# EAGLE design PCB-TLY-JACK_inverter (EAGLE 7.7.0)

## Sheet 1 of 2
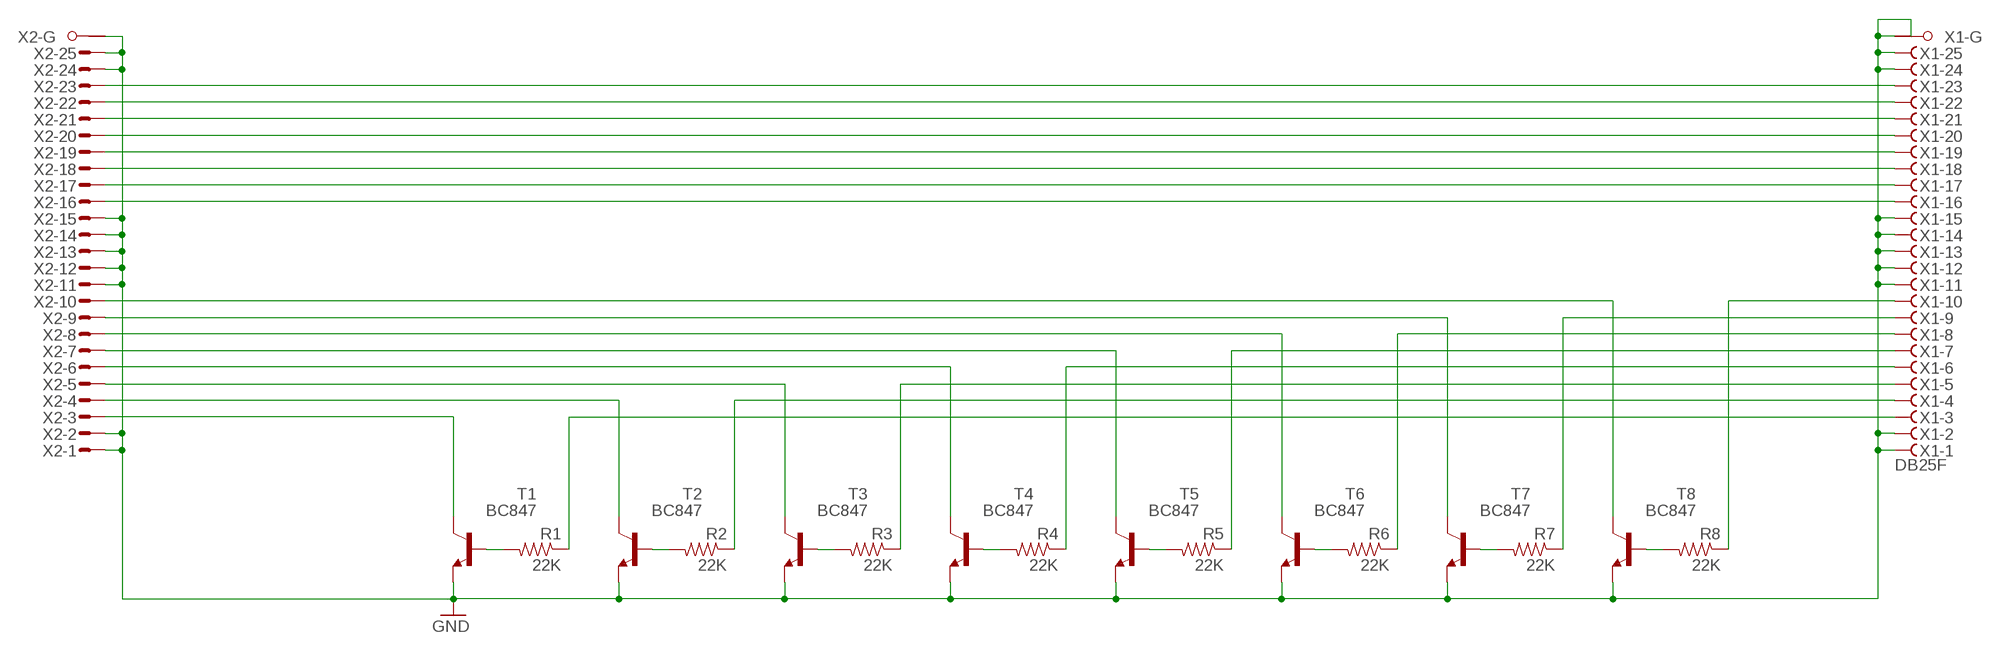
[diagram p0: schematic, sheet 1]

### Parts
R1  22K  RESISTOR0603-RES  [0603-RES]
R2  22K  RESISTOR0603-RES  [0603-RES]
R3  22K  RESISTOR0603-RES  [0603-RES]
R4  22K  RESISTOR0603-RES  [0603-RES]
R5  22K  RESISTOR0603-RES  [0603-RES]
R6  22K  RESISTOR0603-RES  [0603-RES]
R7  22K  RESISTOR0603-RES  [0603-RES]
R8  22K  RESISTOR0603-RES  [0603-RES]
T1  BC847  [SOT23]
T2  BC847  [SOT23]
T3  BC847  [SOT23]
T4  BC847  [SOT23]
T5  BC847  [SOT23]
T6  BC847  [SOT23]
T7  BC847  [SOT23]
T8  BC847  [SOT23]
X1  DB25F  F25HPS  [F25HP]
X2  M25HPS  [M25HP]

### Nets
GND: T1.2(E) T2.2(E) T3.2(E) T4.2(E) T5.2(E) T6.2(E) T7.2(E) T8.2(E) X1.1(-1:F) X1.2(-2:F) X1.11(-11:F) X1.12(-12:F) X1.13(-13:F) X1.14(-14:F) X1.15(-15:F) X1.24(-24:F) X1.25(-25:F) X1.G1(-G:G1) X1.G2(-G:G2) X2.1(-1:M) X2.2(-2:M) X2.11(-11:M) X2.12(-12:M) X2.13(-13:M) X2.14(-14:M) X2.15(-15:M) X2.24(-24:M) X2.25(-25:M) X2.G1(-G:G1)
N$1 [RELAY LINES]: X1.23(-23:F) X2.23(-23:M)
N$2 [INput lines]: T8.3(C) X2.10(-10:M)
N$4: R1.2 T1.1(B)
N$5 [INput lines]: T7.3(C) X2.9(-9:M)
N$6 [RELAY LINES]: X1.22(-22:F) X2.22(-22:M)
N$7 [INput lines]: T6.3(C) X2.8(-8:M)
N$8 [INput lines]: T5.3(C) X2.7(-7:M)
N$9 [INput lines]: T4.3(C) X2.6(-6:M)
N$10 [RELAY LINES]: X1.21(-21:F) X2.21(-21:M)
N$11 [INput lines]: T3.3(C) X2.5(-5:M)
N$12 [INput lines]: T2.3(C) X2.4(-4:M)
N$13: R2.2 T2.1(B)
N$14 [RELAY LINES]: X1.20(-20:F) X2.20(-20:M)
N$15: R3.2 T3.1(B)
N$16: R4.2 T4.1(B)
N$17: R5.2 T5.1(B)
N$18 [RELAY LINES]: X1.19(-19:F) X2.19(-19:M)
N$19: R6.2 T6.1(B)
N$20: R7.2 T7.1(B)
N$21: R8.2 T8.1(B)
N$22 [RELAY LINES]: X1.18(-18:F) X2.18(-18:M)
N$24 [INput lines]: T1.3(C) X2.3(-3:M)
N$25: R1.1 X1.3(-3:F)
N$26 [RELAY LINES]: X1.17(-17:F) X2.17(-17:M)
N$27: R2.1 X1.4(-4:F)
N$28: R3.1 X1.5(-5:F)
N$29: R4.1 X1.6(-6:F)
N$30 [RELAY LINES]: X1.16(-16:F) X2.16(-16:M)
N$31: R5.1 X1.7(-7:F)
N$32: R6.1 X1.8(-8:F)
N$33: R7.1 X1.9(-9:F)
N$34: R8.1 X1.10(-10:F)
Unconnected: X2.G2(-G:G2)

## Sheet 2 of 2

## Library data of the parts
R1-R8 = SparkFun:RESISTOR: Resistor Basic schematic elements and footprints for 0603, 1206, and PTH resistors.
T1-T8 = transistor:BC847: NPN TRANSISTOR
X1 = con-subd:F25HPS: SUB-D; OC_FARNELL: unknown; OC_NEWARK: unknown
X2 = con-subd:M25HPS: SUB-D; OC_FARNELL: unknown; OC_NEWARK: unknown

## Net classes
0 default: width 0.203 mm, drill 0.406 mm, clearance 0.203 mm
1 Power: width 0.406 mm, drill 0.61 mm, clearance 0.203 mm
2 RELAY LINES: width 0.305 mm, drill 0.406 mm, clearance 0.254 mm
3 INput lines: width 0.203 mm, drill 0.406 mm, clearance 0.254 mm

## Board
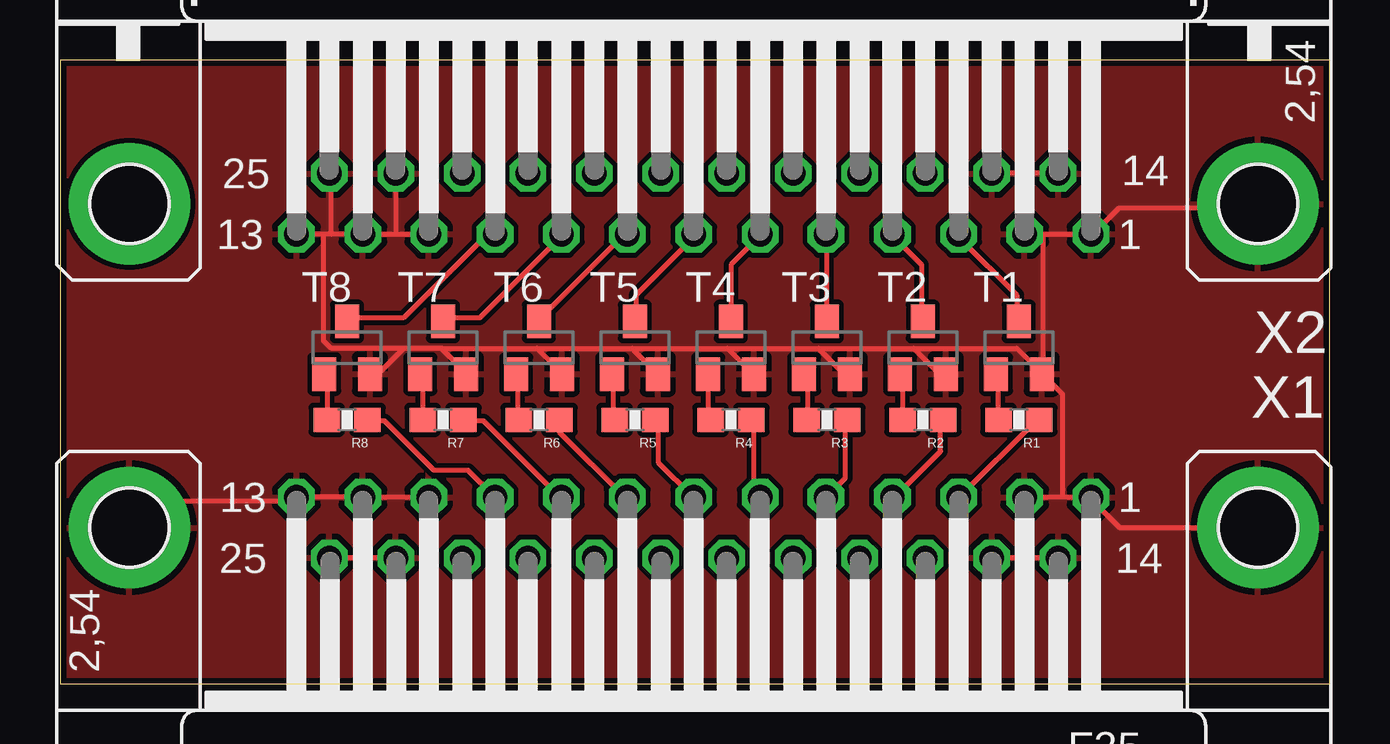
[diagram p1: board, top side]
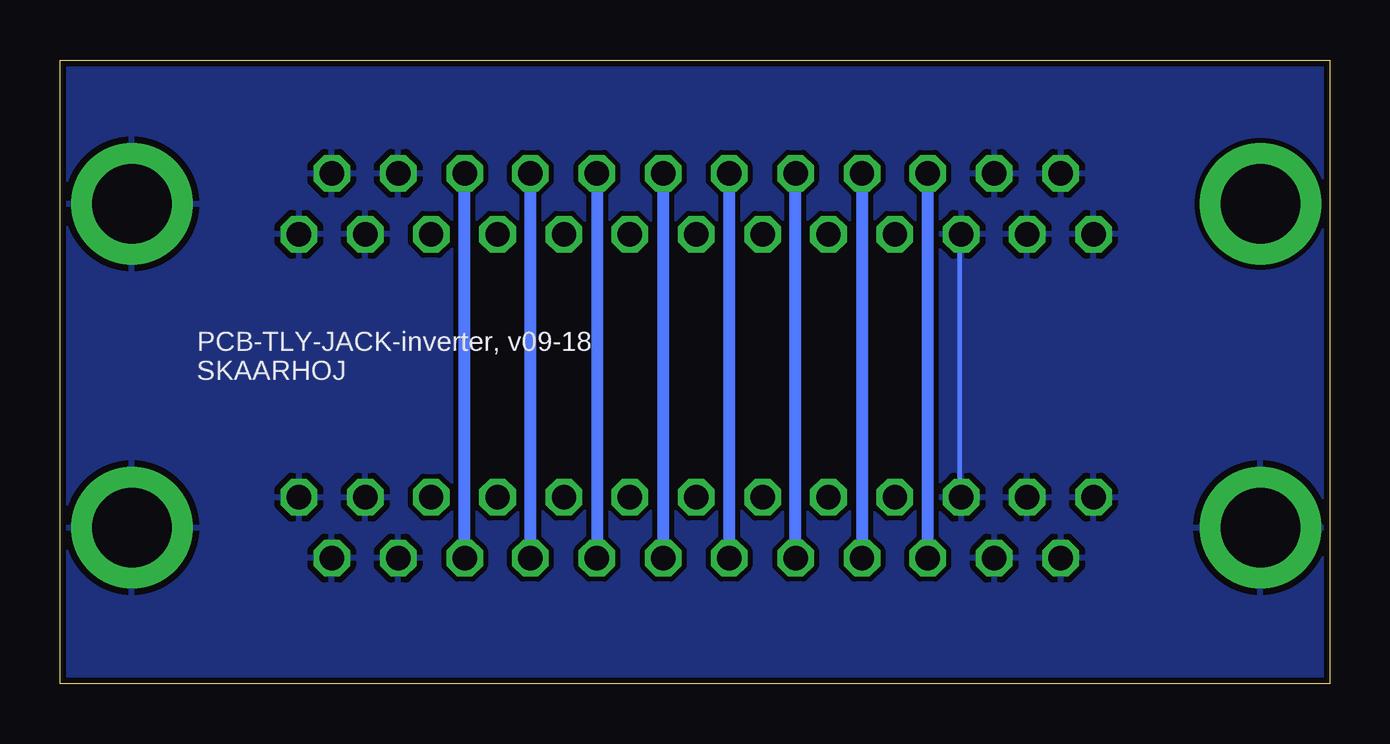
[diagram p2: board, bottom side, seen from below]

Size 52.94 x 26 mm. Coordinates in mm from the lower left corner, seen from the top.
Outline: 52.94,0 52.94,26 0,26 0,0 52.94,0
Copper layers (1*16): Top 0.035mm / dielectric 1.5mm / Bottom 0.035mm
Design rules "Fusion_eagle_rule_v1.1": minimum track width 6mil, minimum drill 12mil, track to track 6mil, track to pad 6mil, pad to pad 6mil, via to via 6mil, smd to smd 0mil, copper to edge 10mil, drill to drill 10mil, minimum pad ring 10mil, minimum via ring 6mil, stop-mask expansion 2mil, vias tented up to drill 100mil, thermal gap 10mil

### Footprints (pad centres in the part's own frame; a part is rotated, then mirrored left to right if it is on the bottom)
0603-RES = smd 1.1 x 1: 1 -0.85,0; 2 0.85,0
SOT23 = smd 1 x 1.4: 1 -0.95,-1.1; 2 0.95,-1.1; 3 0,1.1
F25HP = drill 1.016 octagon: 1 -16.561,-1.27; 2 -13.792,-1.27; 3 -11.049,-1.27; 4 -8.28,-1.27; 5 -5.512,-1.27; 6 -2.769,-1.27; 7 0,-1.27; 8 2.769,-1.27; 9 5.512,-1.27; 10 8.28,-1.27; 11 11.049,-1.27; 12 13.792,-1.27; 13 16.561,-1.27; 14 -15.189,1.27; 15 -12.421,1.27; 16 -9.652,1.27; 17 -6.909,1.27; 18 -4.14,1.27; 19 -1.372,1.27; 20 1.372,1.27; 21 4.14,1.27; 22 6.909,1.27; 23 9.652,1.27; 24 12.421,1.27; 25 15.189,1.27 | drill 3.302 pad 5.08: G1 -23.52,0; G2 23.52,0
M25HP = drill 1.016 octagon: 1 -16.561,1.27; 2 -13.792,1.27; 3 -11.049,1.27; 4 -8.28,1.27; 5 -5.512,1.27; 6 -2.769,1.27; 7 0,1.27; 8 2.769,1.27; 9 5.512,1.27; 10 8.28,1.27; 11 11.049,1.27; 12 13.792,1.27; 13 16.561,1.27; 14 -15.189,-1.27; 15 -12.421,-1.27; 16 -9.652,-1.27; 17 -6.909,-1.27; 18 -4.14,-1.27; 19 -1.372,-1.27; 20 1.372,-1.27; 21 4.14,-1.27; 22 6.909,-1.27; 23 9.652,-1.27; 24 12.421,-1.27; 25 15.189,-1.27 | drill 3.302 pad 5.08: G1 -23.52,0; G2 23.52,0

### Placement (x,y rotation side)
R1  39.97,11 180 top
R2  35.97,11 180 top
R3  31.97,11 180 top
R4  27.97,11 180 top
R5  23.97,11 180 top
R6  19.97,11 180 top
R7  15.97,11 180 top
R8  11.97,11 180 top
T1  39.97,14 0 top
T2  35.97,14 0 top
T3  31.97,14 0 top
T4  27.97,14 0 top
T5  23.97,14 0 top
T6  19.97,14 0 top
T7  15.97,14 0 top
T8  11.97,14 0 top
X1  26.42,6.5 180 top
X2  26.42,20 180 top

### Tracks (layer width: path | path; a pad name or v marks a point on that pad's centre or on a via)
GND
  Top 0.203: 11.3,18.73 12.57,18.73 X2.12 12.73,18.73 14,18.73 | 11.3,18.73 10.99,18.73 | 10.99,18.73 9.87,18.73 X2.13 | 14,18.73 15.27,18.73 X2.11 | 11.3,18.73 11.3,21.11 X2.25 | 14,18.73 14,21.11 X2.24 | 12.57,5.24 13.84,5.24 X1.24 | 12.57,5.24 11.3,5.24 X1.25 | X1.12 12.57,7.78 9.87,7.78 X1.13 9.72,7.62 4.16,7.62 3.05,6.51 X1.G2 | X1.11 15.27,7.78 12.73,7.78 X1.12 | 12.57,5.24 12.57,7.62 X1.12 | 40.19,21.27 41.47,21.27 X2.14 | 40.19,21.27 38.93,21.27 X2.15 | 40.19,21.27 40.19,18.73 X2.2 40.35,18.73 40.99,18.73 | 40.99,18.73 42.89,18.73 X2.1 43.05,18.73 44.16,19.84 49.88,19.84 X2.G1 | 40.19,5.24 41.47,5.24 X1.14 | 40.19,5.24 38.93,5.24 X1.15 | 40.19,5.24 40.19,7.62 X1.2 40.35,7.78 41.78,7.78 | 41.78,7.78 42.89,7.78 X1.1 43.05,7.62 44.16,6.51 49.88,6.51 X1.G1 | 14.32,13.97 13.37,13.02 13.05,13.02 T8.2 | 15.91,13.97 14.32,13.97 | 15.91,13.97 16.86,13.02 T7.2 | 19.88,13.97 20.83,13.02 T6.2 | 15.91,13.97 19.88,13.97 | 23.84,13.97 24.8,13.02 T5.2 | 19.88,13.97 23.84,13.97 | 27.81,13.97 28.77,13.02 T4.2 | 23.84,13.97 27.81,13.97 | 31.62,13.97 32.58,13.02 32.89,13.02 T3.2 | 27.81,13.97 31.62,13.97 | 35.59,13.97 36.54,13.02 36.86,13.02 T2.2 | 31.62,13.97 35.59,13.97 | 35.59,13.97 39.88,13.97 40.83,13.02 T1.2 | 41.78,7.78 41.78,12.06 40.99,12.86 T1.2 | 40.99,18.73 40.99,13.02 T1.2 | 10.99,18.73 10.99,14.29 11.3,13.97 14.32,13.97
  Bottom 0.203: X2.11 15.43,18.57 15.43,7.78 X1.11
  pour Top: 0,0 52.83,0 52.83,25.91 0,25.91
  pour Bottom: 0,0 52.83,0 52.83,25.91 0,25.91
N$1
  Bottom 0.508: X1.23 X2.23
N$2
  Top 0.203: T8.3 12.1,15.24 14.32,15.24 17.65,18.57 18.13,18.57 X2.10
N$4
  Top 0.203: R1.2 39.08,11.11 39.08,12.86 T1.1
N$5
  Top 0.203: T7.3 16.07,15.24 17.49,15.24 20.83,18.57 X2.9
N$6
  Bottom 0.508: X2.22 X1.22
N$7
  Top 0.203: T6.3 20.03,15.24 23.53,18.73 X2.8
N$8
  Top 0.203: T5.3 24,15.24 24,16.19 26.38,18.57 X2.7
N$9
  Top 0.203: T4.3 27.97,15.24 27.97,17.46 29.08,18.57 X2.6
N$10
  Bottom 0.508: X1.21 X2.21
N$11
  Top 0.203: T3.3 31.94,15.24 31.94,18.57 X2.5
N$12
  Top 0.203: T2.3 35.91,15.24 35.91,17.46 34.8,18.57 X2.4
N$13
  Top 0.203: R2.2 35.12,11.11 35.12,12.86 T2.1
N$14
  Bottom 0.508: X2.20 X1.20
N$15
  Top 0.203: R3.2 31.15,11.11 31.15,12.86 T3.1
N$16
  Top 0.203: R4.2 27.02,11.11 27.02,12.86 T4.1
N$17
  Top 0.203: R5.2 23.05,11.11 23.05,12.86 T5.1
N$18
  Bottom 0.508: X1.19 X2.19
N$19
  Top 0.203: R6.2 19.08,11.11 19.08,12.86 T6.1
N$20
  Top 0.203: R7.2 15.11,11.11 15.11,12.86 T7.1
N$21
  Top 0.203: R8.2 11.14,11.11 11.14,12.86 T8.1
N$22
  Bottom 0.508: X2.18 X1.18
N$24
  Top 0.203: T1.3 39.88,15.24 39.88,16.19 37.5,18.57 X2.3
N$25
  Top 0.203: R1.1 40.67,10.95 37.5,7.78 X1.3
N$26
  Bottom 0.508: X1.17 X2.17
N$27
  Top 0.203: R2.1 36.7,10.95 36.7,9.68 34.8,7.78 X1.4
N$28
  Top 0.203: R3.1 32.73,10.95 32.73,8.57 31.94,7.78 X1.5
N$29
  Top 0.203: R4.1 28.92,10.95 28.92,7.94 29.08,7.78 X1.6
N$30
  Bottom 0.508: X1.16 X2.16
N$31
  Top 0.203: R5.1 24.96,10.95 24.96,9.21 26.38,7.78 X1.7
N$32
  Top 0.203: R6.1 20.83,10.95 20.83,10.48 23.53,7.78 X1.8
N$33
  Top 0.203: R7.1 16.86,10.95 17.65,10.95 20.83,7.78 X1.9
N$34
  Top 0.203: R8.1 12.89,10.95 13.53,10.95 15.59,8.89 17.02,8.89 X1.10

### Text on the board
_bsilk: PCB-TLY-JACK-inverter, v09-18 / SKAARHOJ